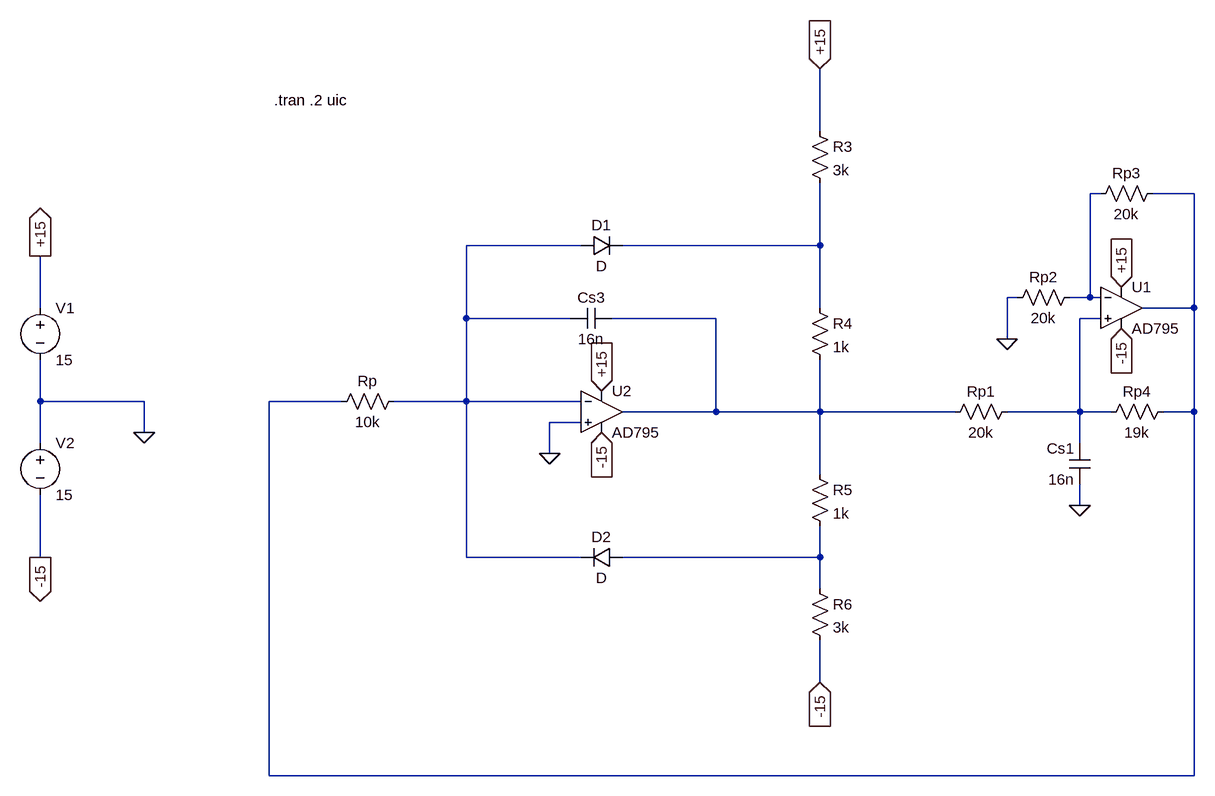
[diagram p0: schematic Oscilador_em_Quadratura.asc]
Oscilador_em_Quadratura.asc, the LTspice schematic file:
Version 4
SHEET 1 1508 912
WIRE 528 -240 528 -336
WIRE 960 -144 944 -144
WIRE 1104 -144 1040 -144
WIRE 160 -64 -16 -64
WIRE 528 -64 528 -160
WIRE 528 -64 224 -64
WIRE 832 16 816 16
WIRE 944 16 944 -144
WIRE 944 16 912 16
WIRE 960 16 944 16
WIRE -672 32 -672 -48
WIRE 528 32 528 -64
WIRE 1104 32 1104 -144
WIRE 1104 32 1024 32
WIRE -16 48 -16 -64
WIRE 144 48 -16 48
WIRE 368 48 208 48
WIRE 960 48 928 48
WIRE 816 80 816 16
WIRE -672 176 -672 112
WIRE -512 176 -672 176
WIRE -208 176 -320 176
WIRE -16 176 -16 48
WIRE -16 176 -128 176
WIRE 160 176 -16 176
WIRE 368 192 368 48
WIRE 368 192 224 192
WIRE 528 192 528 112
WIRE 528 192 368 192
WIRE 736 192 528 192
WIRE 928 192 928 48
WIRE 928 192 816 192
WIRE 976 192 928 192
WIRE 1104 192 1104 32
WIRE 1104 192 1056 192
WIRE 160 208 112 208
WIRE -512 224 -512 176
WIRE -672 240 -672 176
WIRE 928 240 928 192
WIRE 112 256 112 208
WIRE 528 288 528 192
WIRE 928 336 928 304
WIRE -672 416 -672 320
WIRE -16 416 -16 176
WIRE 160 416 -16 416
WIRE 528 416 528 368
WIRE 528 416 224 416
WIRE 528 464 528 416
WIRE 528 608 528 544
WIRE -320 752 -320 176
WIRE 1104 752 1104 192
WIRE 1104 752 -320 752
FLAG 112 256 0
FLAG 528 -336 +15
IOPIN 528 -336 In
FLAG 528 608 -15
IOPIN 528 608 In
FLAG -512 224 0
FLAG -672 -48 +15
IOPIN -672 -48 Out
FLAG -672 416 -15
IOPIN -672 416 Out
FLAG 192 160 +15
IOPIN 192 160 In
FLAG 192 224 -15
IOPIN 192 224 In
FLAG 816 80 0
FLAG 992 0 +15
IOPIN 992 0 In
FLAG 992 64 -15
IOPIN 992 64 In
FLAG 928 336 0
SYMBOL res -224 192 R270
WINDOW 0 32 56 VTop 2
WINDOW 3 0 56 VBottom 2
SYMATTR InstName Rp
SYMATTR Value 10k
SYMBOL diode 160 -48 R270
WINDOW 0 32 32 VTop 2
WINDOW 3 0 32 VBottom 2
SYMATTR InstName D1
SYMBOL diode 224 400 R90
WINDOW 0 0 32 VBottom 2
WINDOW 3 32 32 VTop 2
SYMATTR InstName D2
SYMBOL res 512 272 R0
SYMATTR InstName R5
SYMATTR Value 1k
SYMBOL res 512 16 R0
SYMATTR InstName R4
SYMATTR Value 1k
SYMBOL res 512 -256 R0
SYMATTR InstName R3
SYMATTR Value 3k
SYMBOL res 512 448 R0
SYMATTR InstName R6
SYMATTR Value 3k
SYMBOL voltage -672 16 R0
WINDOW 123 0 0 Left 2
WINDOW 39 24 124 Left 2
SYMATTR InstName V1
SYMATTR Value 15
SYMBOL voltage -672 224 R0
WINDOW 123 0 0 Left 2
WINDOW 39 0 0 Left 2
SYMATTR InstName V2
SYMATTR Value 15
SYMBOL Opamps\\AD795 192 128 R0
SYMATTR InstName U2
SYMBOL cap 208 32 R90
WINDOW 0 0 32 VBottom 2
WINDOW 3 32 32 VTop 2
SYMATTR InstName Cs3
SYMATTR Value 16n
SYMBOL Opamps\\AD795 992 -32 R0
SYMATTR InstName U1
SYMBOL res 720 208 R270
WINDOW 0 32 56 VTop 2
WINDOW 3 0 56 VBottom 2
SYMATTR InstName Rp1
SYMATTR Value 20k
SYMBOL res 816 32 R270
WINDOW 0 32 56 VTop 2
WINDOW 3 0 56 VBottom 2
SYMATTR InstName Rp2
SYMATTR Value 20k
SYMBOL res 944 -128 R270
WINDOW 0 32 56 VTop 2
WINDOW 3 0 56 VBottom 2
SYMATTR InstName Rp3
SYMATTR Value 20k
SYMBOL res 960 208 R270
WINDOW 0 32 56 VTop 2
WINDOW 3 0 56 VBottom 2
SYMATTR InstName Rp4
SYMATTR Value 19k
SYMBOL cap 944 304 R180
WINDOW 0 24 56 Left 2
WINDOW 3 24 8 Left 2
SYMATTR InstName Cs1
SYMATTR Value 16n
TEXT -312 -288 Left 2 !.tran .2 uic

The netlist it stands for:
* Oscilador_em_Quadratura.asc
Rp N002 N003 10k
D1 N003 N004 D
D2 N007 N003 D
R5 N005 N007 1k
R4 N004 N005 1k
R3 +15 N004 3k
R6 N007 -15 3k
V1 +15 0 15
V2 0 -15 15
XU2 0 N003 +15 -15 N005 AD795  ; pins In+ In- V+ V- OUT
Cs3 N005 N003 16n
XU1 N006 N001 +15 -15 N002 AD795  ; pins In+ In- V+ V- OUT
Rp1 N005 N006 20k
Rp2 0 N001 20k
Rp3 N001 N002 20k
Rp4 N006 N002 19k
Cs1 0 N006 16n
.model D D
.lib standard.dio
.tran .2 uic
.lib ADI1.lib
.backanno
.end